# EAGLE schematic midicontrol (EAGLE 9.4.0)
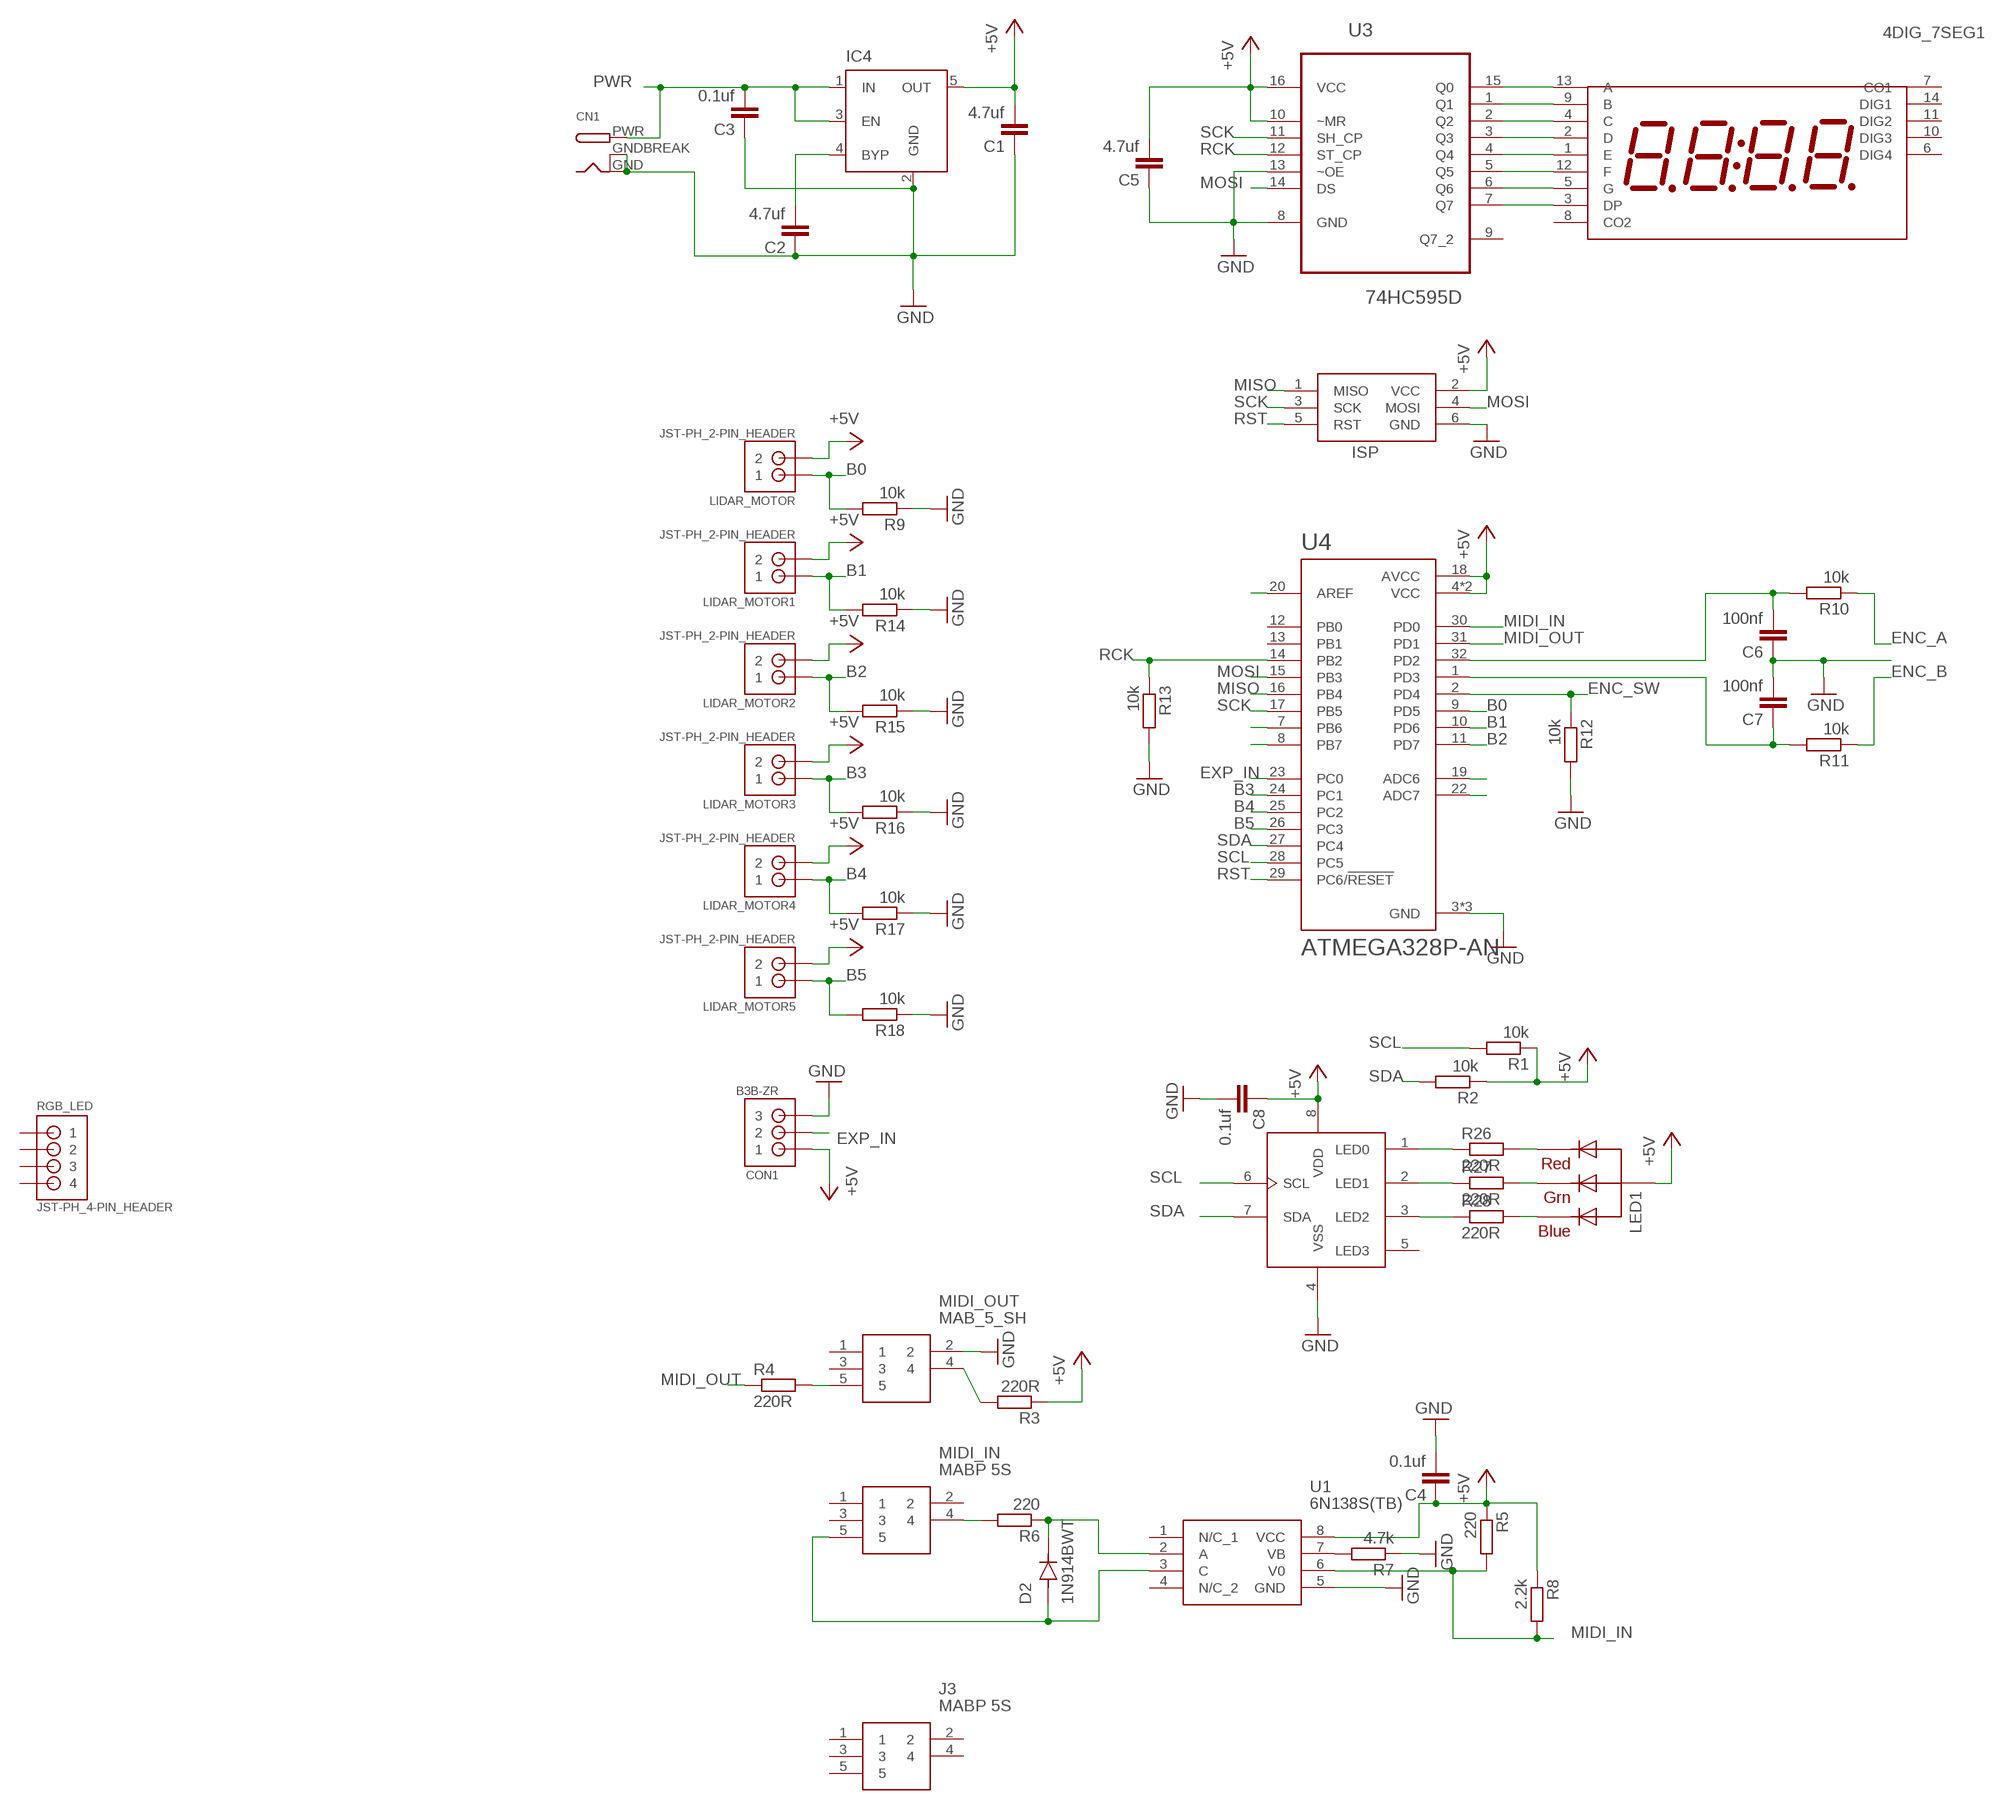
[diagram p0: schematic, sheet 1]

## Parts
4DIG_7SEG1  4DIG_7SEG  [4DIG_7SEG]
C1  4.7uf  C-EUC1206  [C1206]
C2  4.7uf  C-EUC1206  [C1206]
C3  0.1uf  C-EUC1206  [C1206]
C4  0.1uf  C-EUC1206  [C1206]
C5  4.7uf  C-EUC1206  [C1206]
C6  100nf  C-EUC1206  [C1206]
C7  100nf  C-EUC1206  [C1206]
C8  0.1uf  C-EUC1206  [C1206]
CN1  DCBARRELPTH  [DCJACK_2MM_PTH]
CON1  B3B-ZR  [B3B-ZR]
D2  1N914BWT  [SODFL1608X70N]
IC4  MIC5219XX  [SOT23-5]
ISP  AVRISP-6  [AVRISP]
J3  MABP 5S  MAB_5_SH  [MAB-5-SH]
LED1  RGBLED_CA-5MM  [LED5MMRGB]
LIDAR_MOTOR  JST-PH_2-PIN_HEADER  [JST_B2B-PH_HEADER]
LIDAR_MOTOR1  JST-PH_2-PIN_HEADER  [JST_B2B-PH_HEADER]
LIDAR_MOTOR2  JST-PH_2-PIN_HEADER  [JST_B2B-PH_HEADER]
LIDAR_MOTOR3  JST-PH_2-PIN_HEADER  [JST_B2B-PH_HEADER]
LIDAR_MOTOR4  JST-PH_2-PIN_HEADER  [JST_B2B-PH_HEADER]
LIDAR_MOTOR5  JST-PH_2-PIN_HEADER  [JST_B2B-PH_HEADER]
MIDI_IN  MABP 5S  MAB_5_SH  [MAB-5-SH]
MIDI_OUT  MAB_5_SH  [MAB-5-SH]
PCA9533  PCA9533  [SOIC8]
R1  10k  R-EU_R0603  [R0603]
R2  10k  R-EU_R0603  [R0603]
R3  220R  R-EU_R0603  [R0603]
R4  220R  R-EU_R0603  [R0603]
R5  220  R-EU_R0603  [R0603]
R6  220  R-EU_R0603  [R0603]
R7  4.7k  R-EU_R0603  [R0603]
R8  2.2k  R-EU_R0603  [R0603]
R9  10k  R-EU_R0603  [R0603]
R10  10k  R-EU_R0603  [R0603]
R11  10k  R-EU_R0603  [R0603]
R12  10k  R-EU_R0603  [R0603]
R13  10k  R-EU_R0603  [R0603]
R14  10k  R-EU_R0603  [R0603]
R15  10k  R-EU_R0603  [R0603]
R16  10k  R-EU_R0603  [R0603]
R17  10k  R-EU_R0603  [R0603]
R18  10k  R-EU_R0603  [R0603]
R26  220R  R-EU_R0603  [R0603]
R27  220R  R-EU_R0603  [R0603]
R28  220R  R-EU_R0603  [R0603]
RGB_LED  JST-PH_4-PIN_HEADER  [JST_B4B-PH_HEADER]
U1  6N138S(TB)  [SOP254P1030X460-8N]
U3  74HC595D  [SOIC127P600X175-16N]
U4  ATMEGA328P-AN  [QFP80P900X900X120-32N]

## Nets
+5V: C1.2 C4.1 C5.2 C8.1 CON1.1 IC4.5(OUT) ISP.2(VCC) LED1.2(VCC) LIDAR_MOTOR1.P2 LIDAR_MOTOR2.P2 LIDAR_MOTOR3.P2 LIDAR_MOTOR4.P2 LIDAR_MOTOR5.P2 LIDAR_MOTOR.P2 PCA9533.8(VDD) R1.1 R2.1 R3.1 R5.1 R8.1 U1.8(VCC) U3.10(~MR) U3.16(VCC) U4.4(VCC) U4.6(VCC) U4.18(AVCC)
B0: LIDAR_MOTOR.P1 R9.2 U4.9(PD5)
B1: LIDAR_MOTOR1.P1 R14.2 U4.10(PD6)
B2: LIDAR_MOTOR2.P1 R15.2 U4.11(PD7)
B3: LIDAR_MOTOR3.P1 R16.2 U4.24(PC1)
B4: LIDAR_MOTOR4.P1 R17.2 U4.25(PC2)
B5: LIDAR_MOTOR5.P1 R18.2 U4.26(PC3)
ENC_A: C7.1 R10.1 R11.2 U4.1(PD3)
ENC_B: C6.2 R10.2 R11.1 U4.32(PD2)
ENC_SW: R12.1 U4.2(PD4)
EXP_IN: CON1.2 U4.23(PC0)
GND: C1.1 C2.1 C3.1 C4.2 C5.1 C6.1 C7.2 C8.2 CN1.GND CN1.GNDBREAK CON1.3 IC4.2(GND) ISP.6(GND) MIDI_OUT.2 PCA9533.4(VSS) R7.1 R9.1 R12.2 R13.2 R14.1 R15.1 R16.1 R17.1 R18.1 U1.5(GND) U3.8(GND) U3.13(~OE) U4.3(GND) U4.5(GND) U4.21(GND)
MIDI_IN: R5.2 R8.2 U1.6(V0) U4.30(PD0)
MIDI_OUT: R4.1 U4.31(PD1)
MISO: ISP.1(MISO) U4.16(PB4)
MOSI: ISP.4(MOSI) U3.14(DS) U4.15(PB3)
N$1: 4DIG_7SEG1.13(A) U3.15(Q0)
N$2: 4DIG_7SEG1.9(B) U3.1(Q1)
N$3: 4DIG_7SEG1.4(C) U3.2(Q2)
N$4: 4DIG_7SEG1.2(D) U3.3(Q3)
N$5: 4DIG_7SEG1.1(E) U3.4(Q4)
N$6: 4DIG_7SEG1.12(F) U3.5(Q5)
N$7: 4DIG_7SEG1.5(G) U3.6(Q6)
N$8: 4DIG_7SEG1.3(DP) U3.7(Q7)
N$9: MIDI_OUT.4 R3.2
N$10: MIDI_OUT.5 R4.2
N$11: D2.A MIDI_IN.5 U1.3(C)
N$12: D2.C(K) R6.1 U1.2(A)
N$13: MIDI_IN.4 R6.2
N$14: R7.2 U1.7(VB)
N$15: LED1.1(RED) R26.2
N$16: U4.7(PB6)
N$17: LED1.3(GREEN) R27.2
N$18: LED1.4(BLUE) R28.2
N$19: U4.8(PB7)
N$20: C2.2 IC4.4(BYP)
N$21: U4.20(AREF)
N$22: PCA9533.1(LED0) R26.1
N$23: PCA9533.2(LED1) R27.1
N$24: PCA9533.3(LED2) R28.1
N$26: U4.19(ADC6)
N$27: U4.22(ADC7)
PWR: C3.2 CN1.PWR IC4.1(IN) IC4.3(EN)
RCK: R13.1 U3.12(ST_CP) U4.14(PB2)
RST: ISP.5(RST) U4.29(PC6/!RESET)
SCK: ISP.3(SCK) U3.11(SH_CP) U4.17(PB5)
SCL: PCA9533.6(SCL) R1.2 U4.28(PC5)
SDA: PCA9533.7(SDA) R2.2 U4.27(PC4)
Unconnected: 4DIG_7SEG1.6(DIG4) 4DIG_7SEG1.7(CO1) 4DIG_7SEG1.8(CO2) 4DIG_7SEG1.10(DIG3) 4DIG_7SEG1.11(DIG2) 4DIG_7SEG1.14(DIG1) J3.1 J3.2 J3.3 J3.4 J3.5 MIDI_IN.1 MIDI_IN.2 MIDI_IN.3 MIDI_OUT.1 MIDI_OUT.3 PCA9533.5(LED3) RGB_LED.P1 RGB_LED.P2 RGB_LED.P3 RGB_LED.P4 U1.1(N/C_1) U1.4(N/C_2) U3.9(Q7_2) U4.12(PB0) U4.13(PB1)

## Library data of the parts
4DIG_7SEG1 = 7-seg-disp:4DIG_7SEG: This library is modified to the Adafruit 4dig7seg display, part# KW4-56NCBA-P. It doesn't have the up decimal, and the pins are reassigned. This is common cathode. This library was based on BL-Q39A42 respectively BL-Q39B42 display but support many others displays where PAD/PIN assign is same.Display may be common cathode or common anode because PAD/PIN assign is still the same. PIN DESCRIPTION: DIG1-DIG4 : common cathode or common anode of digit CO1-CO2: cathode or anode of colon (Depends on the display), DIG1-DIG4: common cathodes or anodes of digits, A - G+ DP: cathodes or anodes of segments A to F with dot point . Made by: www.developrog.com, modified by Kiki Jewell 2016
C1-C8 = rcl:C-EU: CAPACITOR, European symbol; SPICEPREFIX: C
CN1 = adafruit:DCBARREL: 2.0mm DC Barrel Jack DCJACK_2MM_PTH - Through Hole Jack (4UConnector: 05537)
CON1 = jst:B3B-ZR: JST-ZH Connector 3 pol, 1.5mm pitch Package: B3B-ZR Source: http://www.jst-mfg.com/product/pdf/eng/eZH.pdf
D2 = 1N914BWT:1N914BWT: 1N914B Series 75 V 300 mA Surface Mount Small Signal Diode - SOD-523F; AVAILABILITY: Unavailable; DESCRIPTION: 1N914B Series 75 V 300 mA Surface Mount Small Signal Diode - SOD-523F; MF: ON Semiconductor; MP: 1N914BWT; PACKAGE: SOD-523F ON Semiconductor; PRICE: None
IC4 = v-reg-micrel:MIC5219XX: VOLTAGE REGULATOR; OC_FARNELL: unknown; OC_NEWARK: unknown
ISP = adafruit:AVRISP: AVR ISP HEADER Standard 6 pin header for AVR programming
J3 MIDI_IN MIDI_OUT = MAB_5_SH:MAB_5_SH: HIRSCHMANN - MAB 5 SH - SOCKET, DIN, PCB, 5PIN Source: Datasheet <http://www.farnell.com/datasheets/1599432.pdf>; DESCRIPTION: HIRSCHMANN - MAB 5 SH - SOCKET, DIN, PCB, 5PIN; HEIGHT: mm; MANUFACTURER_NAME: Hirschmann; MANUFACTURER_PART_NUMBER: MAB 5 SH
LED1 = adafruit:RGBLED_CA: RGB LED, common-anode 5MM Staggered pins 5mm Piranha package http://www.ladyada.net/library/pcb/eaglelibrary.html
LIDAR_MOTOR LIDAR_MOTOR1-LIDAR_MOTOR5 = srg:JST-PH_2-PIN_HEADER: 2-pin JST PH Shrouded Header, top entry P/N B2B-PH-K-S Mating connector PHR-2 Mating cable assembly: Sparkfun PRT-09914 <http://www.sparkfun.com/products/9914>
PCA9533 = adam - ics:PCA9533: PCA9533D/01: LED driver and dimmer 4 channel, PWM @ 8 bit resolution 25mA / channel sink external resistors per LED I2C protocol @ 400kHz (fast) digikey: 568-3372-5-ND, 8-SOIC, $1.92
R1-R18 R26-R28 = rcl:R-EU_: RESISTOR, European symbol; SPICEPREFIX: R
RGB_LED = srg:JST-PH_4-PIN_HEADER: 4-pin JST PH Shrouded Header, top entry P/N B4B-PH-K-S Mating connector PHR-4 Mating cable assembly: Sparkfun PRT-09916 <http://www.sparkfun.com/products/9916>
U1 = 6N138S(TB):6N138S(TB): High Speed Optocouplers Low Input, High Gain DC Input Source: Datasheet <https://componentsearchengine.com/Datasheets/1/6N138S(TB).pdf>; DESCRIPTION: High Speed Optocouplers Low Input, High Gain DC Input; HEIGHT: 4.6mm; MANUFACTURER_NAME: Everlight; MANUFACTURER_PART_NUMBER: 6N138S(TB); MOUSER_PART_NUMBER: 638-6N138STB; MOUSER_PRICE-STOCK: https://www.mouser.com/Search/Refine.aspx?Keyword=638-6N138STB
U3 = 74HC595D:74HC595D: 8-bit serial-in parallel-out shift register; AVAILABILITY: Unavailable; DESCRIPTION: Shift Register Single 8-Bit Serial to Serial/Parallel 16-Pin SO; MF: Toshiba Semiconductor; MP: 74HC595D; PACKAGE: SO-16 NXP Semiconductors; PRICE: None
U4 = ATMEGA328P-AN:ATMEGA328P-AN: ATmega Series 20 MHz 32 KB Flash 2 KB SRAM 8-Bit Microcontroller - TQFP-32; AVAILABILITY: Unavailable; DESCRIPTION: MCU 8-bit ATmega AVR RISC 32KB Flash 2.5V/3.3V/5V 32-Pin TQFP Tray; MF: Microchip; MP: ATMEGA328P-AN; PACKAGE: TQFP-32 Microchip; PRICE: None

## Net classes
0 default: clearance 0.152 mm